# EAGLE design regulator (EAGLE 6.6.0)
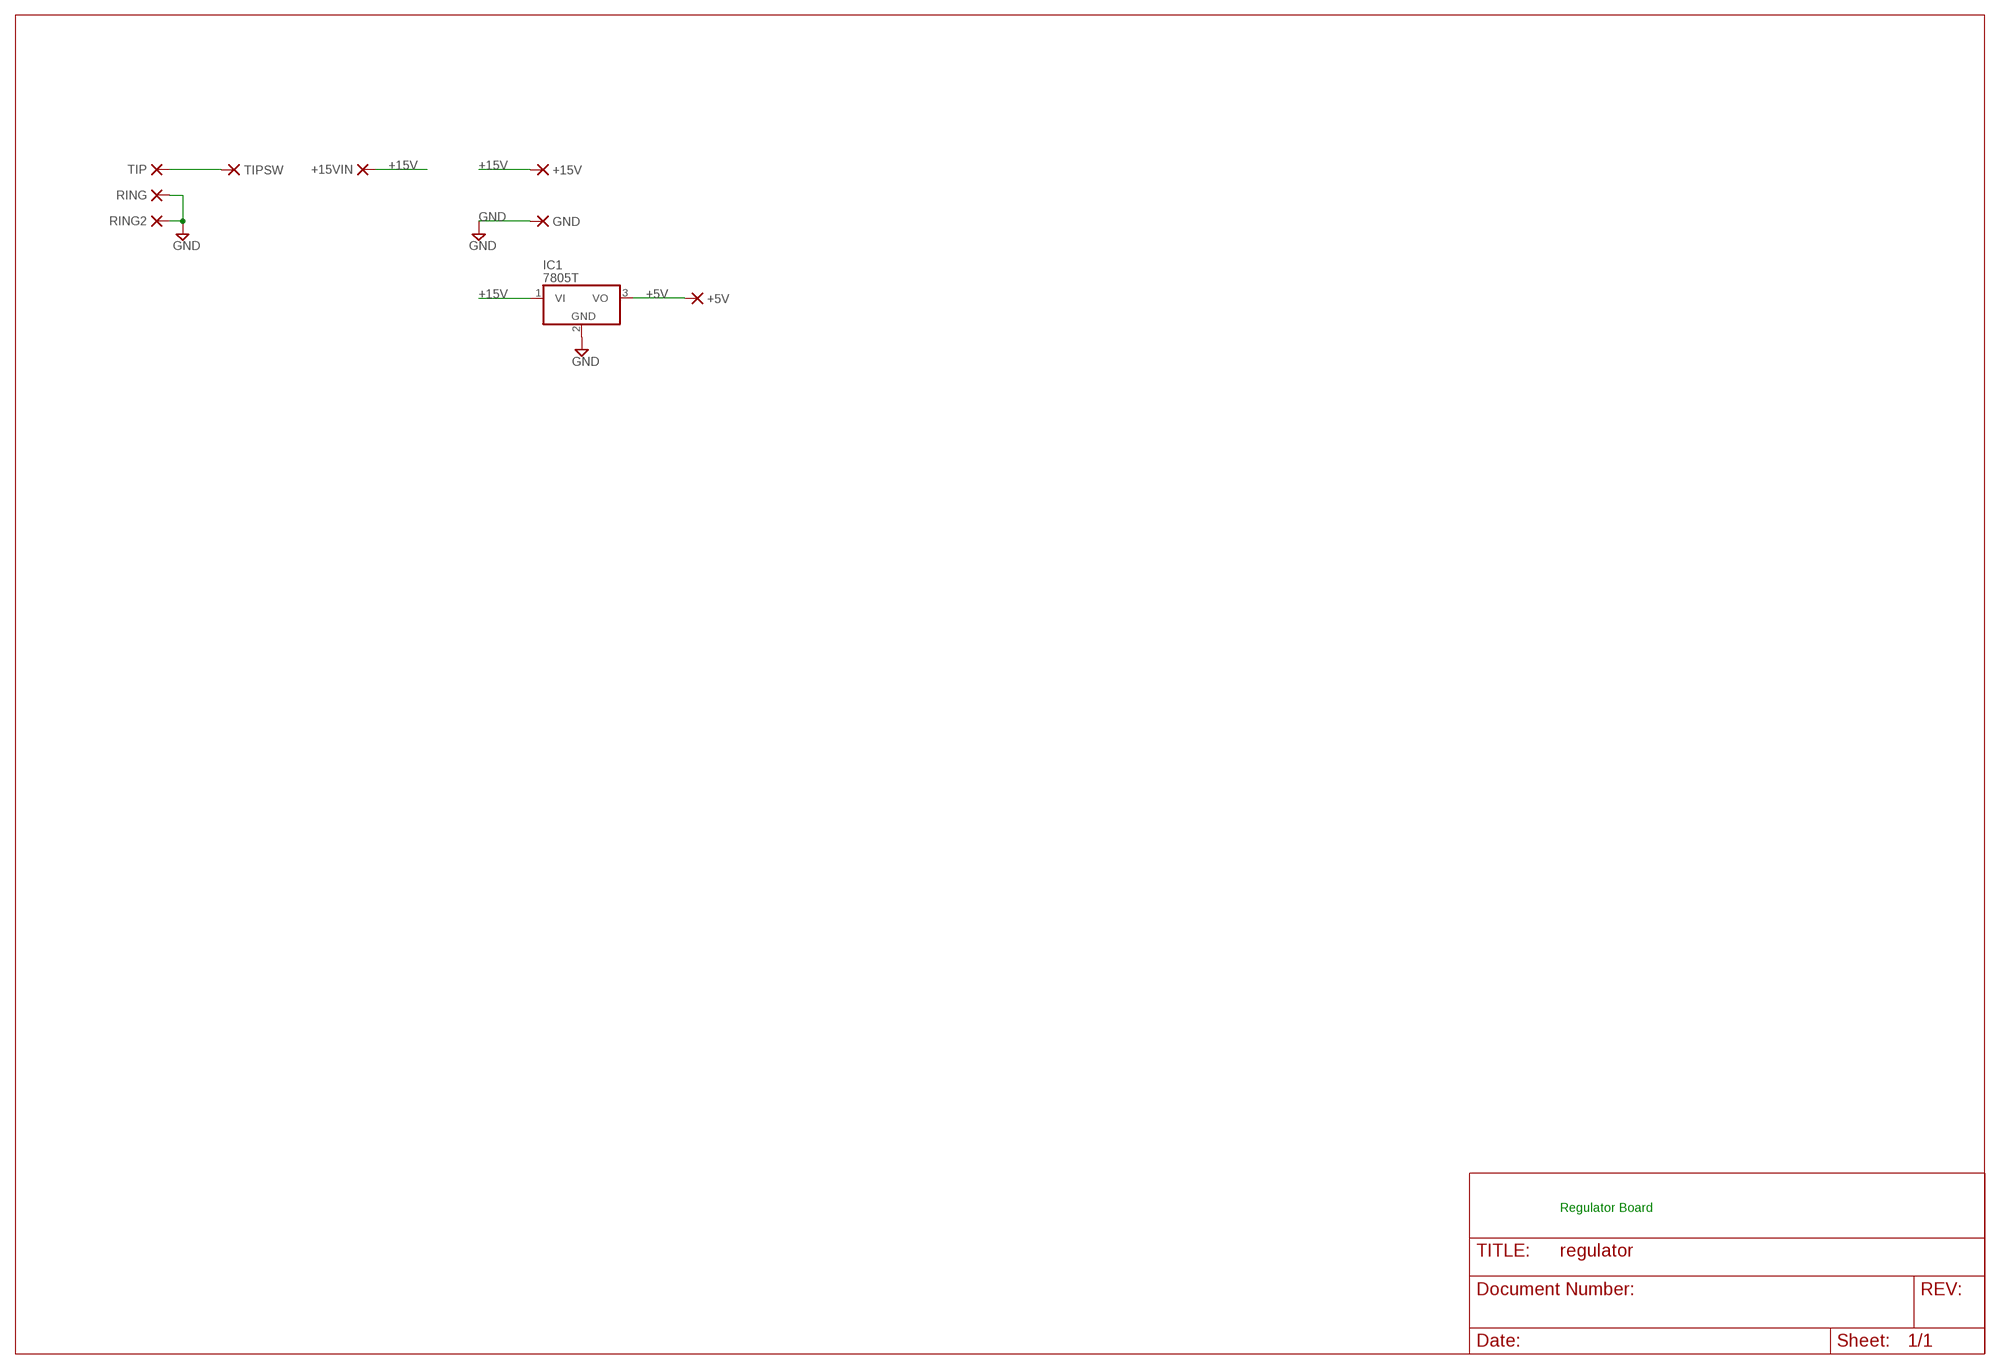
[diagram p0: schematic, sheet 1]

## Parts
+5V  PAD-0635  [0635]
+15V  PAD-0635  [0635]
+15VIN  PAD-0635  [0635]
GND  PAD-0635  [0635]
IC1  7805T  [TO220H]
RING  PAD-0635  [0635]
RING2  PAD-0635  [0635]
TIP  PAD-0635  [0635]
TIPSW  PAD-0635  [0635]

## Nets
+5V [supply]: +5V.P$1(P) IC1.3(VO)
+15V [supply]: +15V.P$1(P) +15VIN.P$1(P) IC1.1(VI)
GND [supply]: GND.P$1(P) IC1.2(GND) RING2.P$1(P) RING.P$1(P)
N$1 [supply]: TIP.P$1(P) TIPSW.P$1(P)

## Notes on the sheet
- Regulator Board

## Library data of the parts
+5V +15V +15VIN GND RING RING2 TIP TIPSW = dec-con:PAD: WIRE PAD Standard US Drill Sizes
IC1 = linear:78*: Positive VOLTAGE REGULATOR Source: http://cache.national.com/ds/LM/LM78L05.pdf http://www.fairchildsemi.com/ds/LM/LM7805.pdf

## Net classes
1 supply: width 0.762 mm

## Board
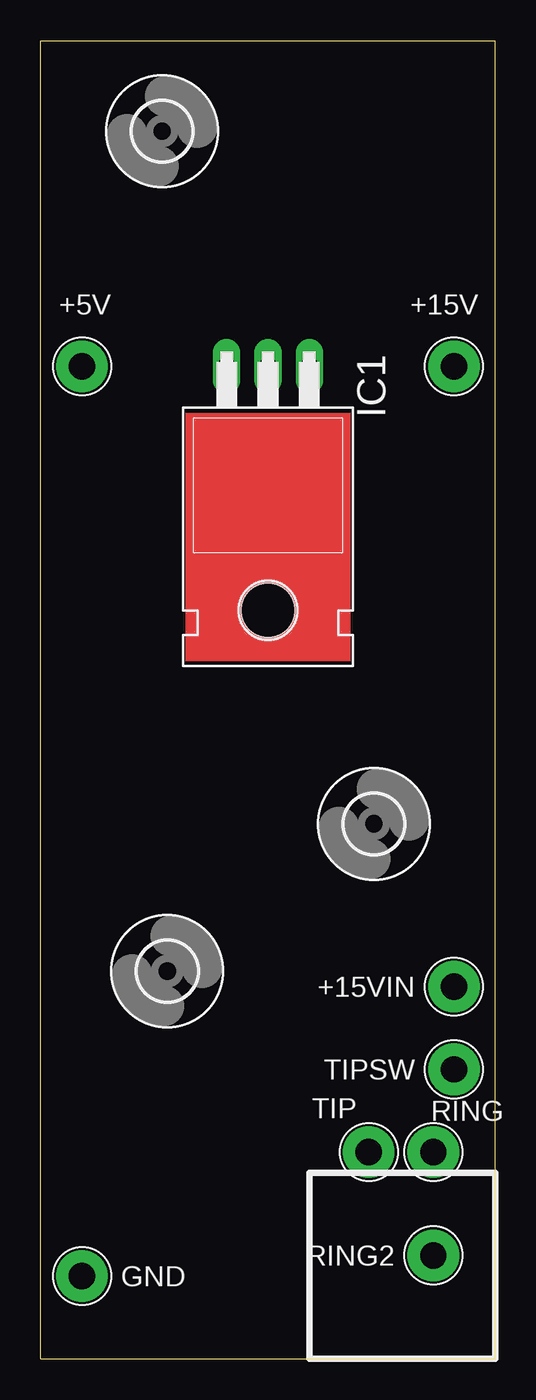
[diagram p1: board, top side]
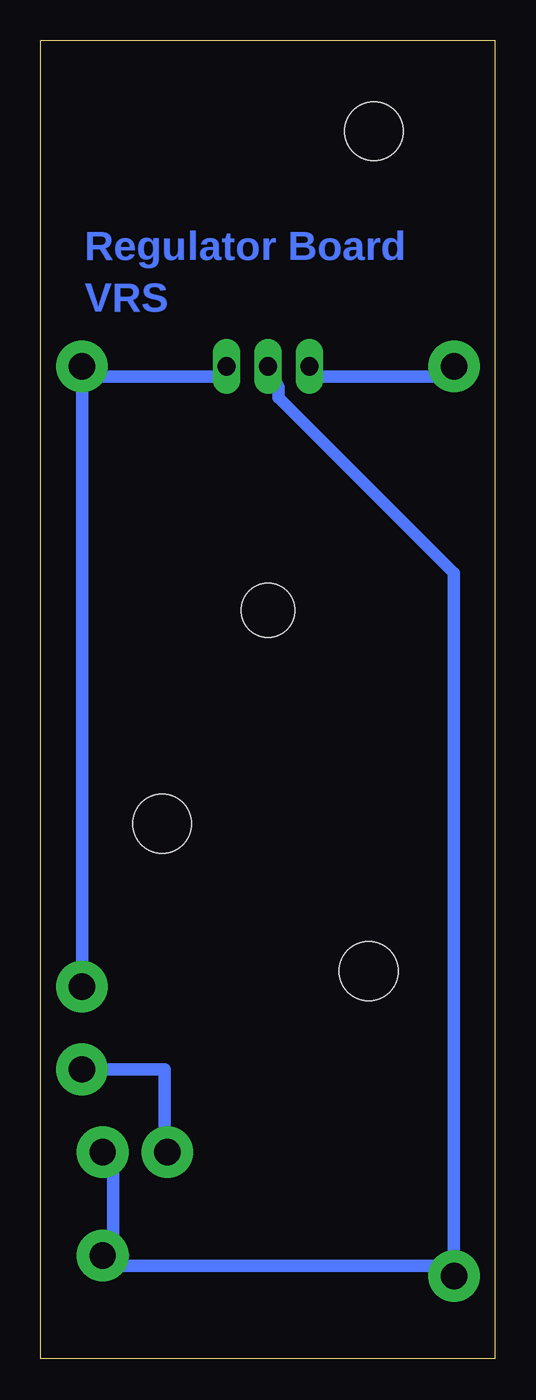
[diagram p2: board, bottom side, seen from below]

Size 27.94 x 80.96 mm. Coordinates in mm from the lower left corner, seen from the top.
Outline: 0,0 0,0
Outline: 0,0 0,0
Outline: 0,0 27.94,0 27.94,80.96 0,80.96 0,0
Copper layers (1*16): Top 0.035mm / dielectric 1.5mm / Bottom 0.035mm
Design rules "15mils": minimum track width 15mil, minimum drill 24mil, track to track 15mil, track to pad 10mil, pad to pad 10mil, via to via 10mil, smd to smd 10mil, copper to edge 25mil, drill to drill 10mil, minimum pad ring 10mil, minimum via ring 8mil, stop-mask expansion 0mil, vias tented up to drill 0mil, thermal gap 10mil

### Footprints (pad centres in the part's own frame; a part is rotated, then mirrored left to right if it is on the bottom)
0635 = drill 1.613 pad 3.175: P$1 0,0
TO220H = drill 1.118 long: 1 -2.54,-10.16; 2 0,-10.16; 3 2.54,-10.16 | hole 3.302: 0,4.826
3,6 = hole 3.6: 0,0

### Placement (x,y rotation side)
+5V  2.54,60.96 0 top
+15V  25.4,60.96 0 top
+15VIN  25.4,22.86 180 top
GND  2.54,5.08 0 top
IC1  13.97,50.8 180 top
RING  24.13,12.7 270 top
RING2  24.13,6.35 180 top
TIP  20.16,12.7 270 top
TIPSW  25.4,17.78 180 top
U$5  [3,6]  7.46,75.41 0 top
U$6  [3,6]  20.48,32.86 0 top
U$7  [3,6]  7.78,23.81 0 top

### Tracks (layer width: path | path; a pad name or v marks a point on that pad's centre or on a via)
+5V
  Bottom 0.762: IC1.3 10.8,60.33 3.81,60.33 +5V.P$1
+15V
  Bottom 0.762: +15VIN.P$1 25.4,24.13 25.4,59.69 +15V.P$1 24.13,60.33 17.15,60.33 IC1.1
GND
  Bottom 0.762: RING2.P$1 22.86,6.35 | RING.P$1 23.5,11.43 23.5,7.62 RING2.P$1 | RING2.P$1 22.86,5.71 3.81,5.71 GND.P$1 2.54,6.35 2.54,48.26 13.34,59.05 13.34,59.69 IC1.2
N$1
  Bottom 0.762: TIPSW.P$1 20.32,17.78 20.32,12.7 TIP.P$1
(copper drawn outside any net)
  shapes: Top area x1

### Text on the board
Bottom: Regulator Board | VRS